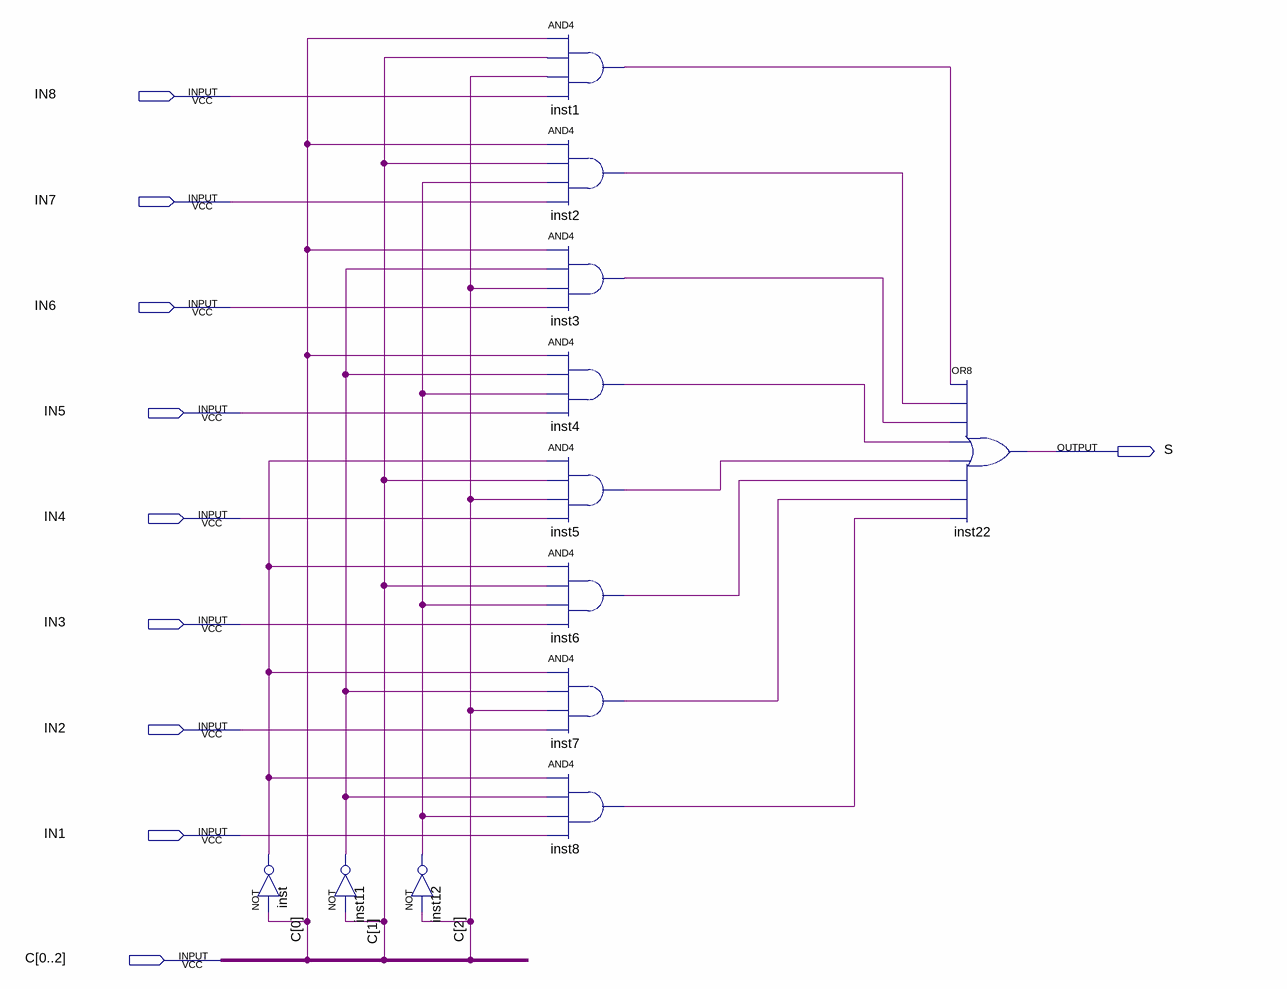
[diagram p0: schematic sheet]
// Quartus schematic Mux.bdf as structural Verilog: 12 symbols, 10 pins
module Mux (
  input  IN8,
  input  IN7,
  input  IN6,
  input  IN5,
  input  IN4,
  input  IN3,
  input  IN2,
  input  IN1,
  input  [0:2] C,
  output S
);

  wire inst1_out, inst2_out, inst3_out, inst4_out, inst5_out, inst6_out, inst7_out, inst8_out, inst11_out,
       inst12_out, inst_out;

  not inst (inst_out, C[0]);
  not inst11 (inst11_out, C[1]);
  not inst12 (inst12_out, C[2]);
  and inst1 (inst1_out, C[0], C[1], C[2], IN8);
  and inst2 (inst2_out, C[0], C[1], inst12_out, IN7);
  and inst3 (inst3_out, C[0], inst11_out, C[2], IN6);
  and inst4 (inst4_out, C[0], inst11_out, inst12_out, IN5);
  and inst5 (inst5_out, inst_out, C[1], C[2], IN4);
  and inst6 (inst6_out, inst_out, C[1], inst12_out, IN3);
  and inst7 (inst7_out, inst_out, inst11_out, C[2], IN2);
  and inst8 (inst8_out, inst_out, inst11_out, inst12_out, IN1);
  or inst22 (S, inst1_out, inst2_out, inst3_out, inst4_out, inst5_out, inst6_out, inst7_out, inst8_out);
endmodule
